# EAGLE schematic main (EAGLE 7.7.0)
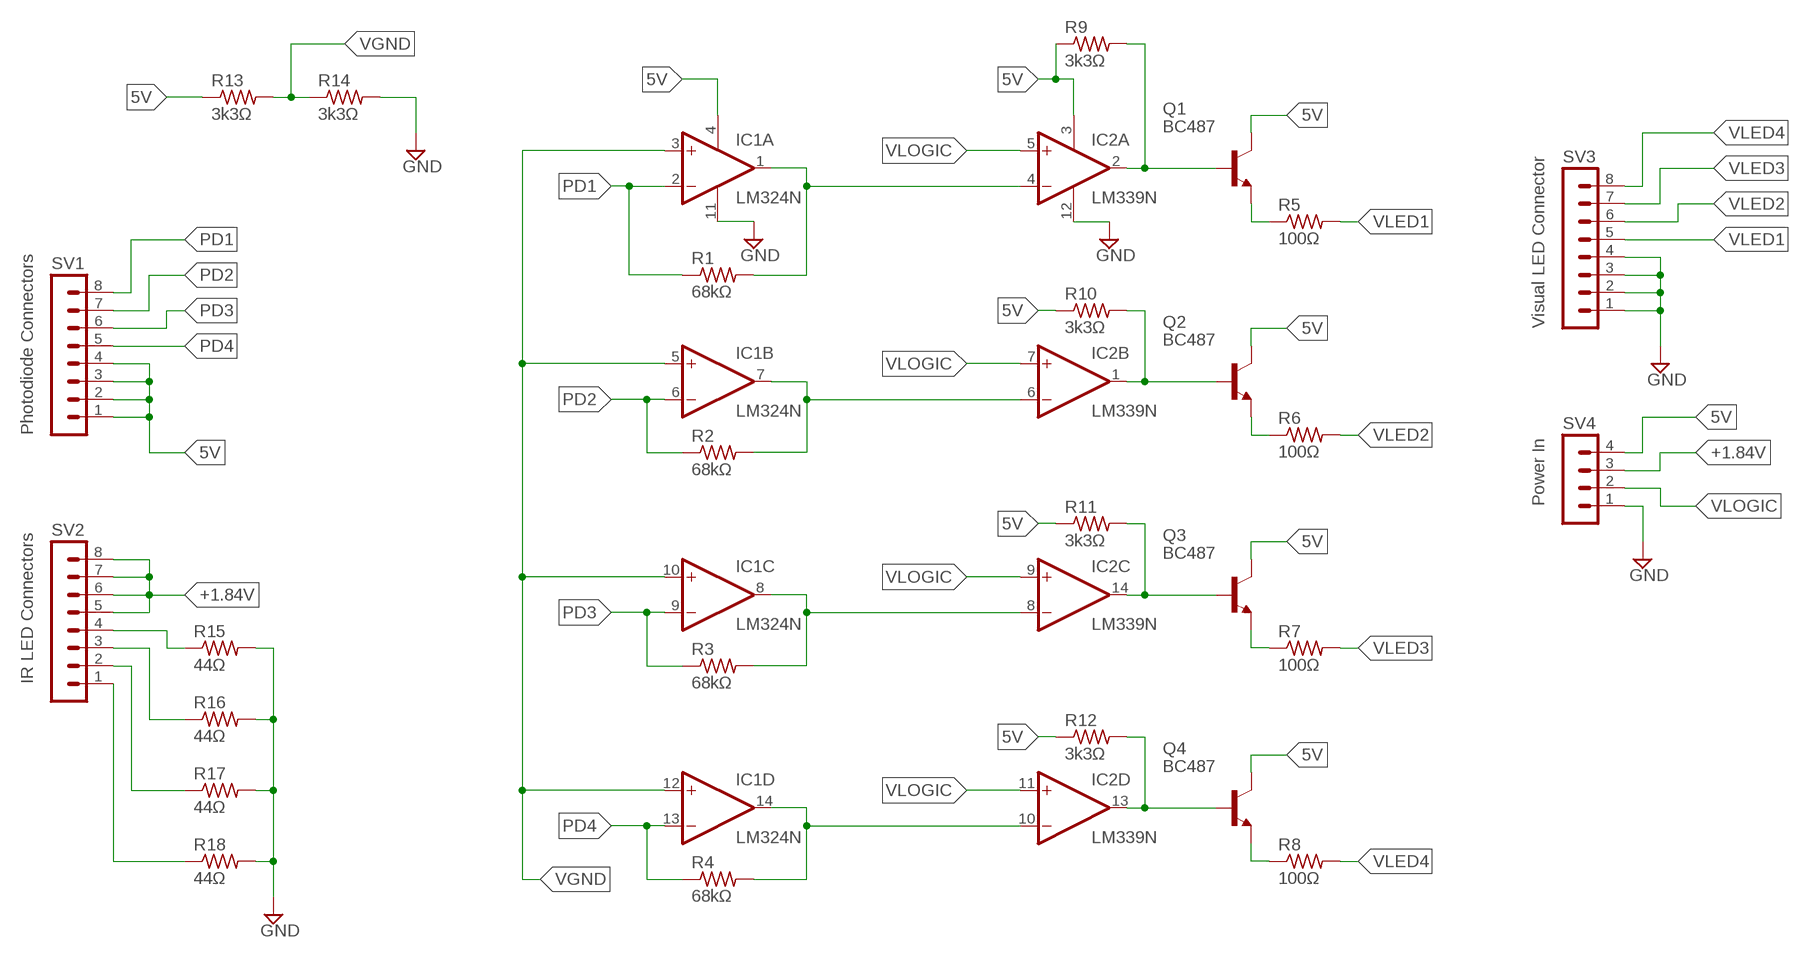
[diagram p0: schematic, sheet 1]

## Parts
IC1  LM324N  [DIL14]
IC2  LM339N  [DIL14]
Q1  BC487  [TO92-EBC]
Q2  BC487  [TO92-EBC]
Q3  BC487  [TO92-EBC]
Q4  BC487  [TO92-EBC]
R1  68kΩ  R-US_0204/7  [0204/7]
R2  68kΩ  R-US_0204/7  [0204/7]
R3  68kΩ  R-US_0204/7  [0204/7]
R4  68kΩ  R-US_0204/7  [0204/7]
R5  100Ω  R-US_0204/7  [0204/7]
R6  100Ω  R-US_0204/7  [0204/7]
R7  100Ω  R-US_0204/7  [0204/7]
R8  100Ω  R-US_0204/7  [0204/7]
R9  3k3Ω  R-US_0204/7  [0204/7]
R10  3k3Ω  R-US_0204/7  [0204/7]
R11  3k3Ω  R-US_0204/7  [0204/7]
R12  3k3Ω  R-US_0204/7  [0204/7]
R13  3k3Ω  R-US_0204/7  [0204/7]
R14  3k3Ω  R-US_0204/7  [0204/7]
R15  44Ω  R-US_0204/7  [0204/7]
R16  44Ω  R-US_0204/7  [0204/7]
R17  44Ω  R-US_0204/7  [0204/7]
R18  44Ω  R-US_0204/7  [0204/7]
SV1  Photodiode Connectors  MA08-1  [MA08-1]
SV2  IR LED Connectors  MA08-1  [MA08-1]
SV3  Visual LED Connector  MA08-1  [MA08-1]
SV4  Power In  MA04-1  [MA04-1]

## Nets
5V: IC1.4(P:V+) IC2.3(P:V+) Q1.C Q2.C Q3.C Q4.C R9.1 R10.1 R11.1 R12.1 R13.1 SV1.1 SV1.2 SV1.3 SV1.4 SV4.4
+1.84V: SV2.5 SV2.6 SV2.7 SV2.8 SV4.3
GND: IC1.11(P:V-) IC2.12(P:GND) R14.2 R15.2 R16.2 R17.2 R18.2 SV3.1 SV3.2 SV3.3 SV3.4 SV4.1
N$1: Q1.E R5.1
N$2: IC1.1(A:OUT) IC2.4(A:-IN) R1.2
N$3: IC1.7(B:OUT) IC2.6(B:-IN) R2.2
N$4: Q2.E R6.1
N$5: Q3.E R7.1
N$6: Q4.E R8.1
N$7: IC1.14(D:OUT) IC2.10(D:-IN) R4.2
N$8: IC2.14(C:OUT) Q3.B R11.2
N$9: IC2.13(D:OUT) Q4.B R12.2
N$10: IC2.1(B:OUT) Q2.B R10.2
N$11: IC2.2(A:OUT) Q1.B R9.2
N$12: R15.1 SV2.4
N$13: R16.1 SV2.3
N$14: R17.1 SV2.2
N$15: R18.1 SV2.1
PD1: IC1.2(A:-IN) R1.1 SV1.8
PD2: IC1.6(B:-IN) R2.1 SV1.7
PD3: IC1.9(C:-IN) R3.1 SV1.6
PD4: IC1.13(D:-IN) R4.1 SV1.5
VGND: IC1.3(A:+IN) IC1.5(B:+IN) IC1.10(C:+IN) IC1.12(D:+IN) R13.2 R14.1
VLED1: R5.2 SV3.5
VLED2: R6.2 SV3.6
VLED3: R7.2 SV3.7
VLED4: R8.2 SV3.8
VLOGIC: IC1.8(C:OUT) IC2.5(A:+IN) IC2.7(B:+IN) IC2.8(C:-IN) IC2.9(C:+IN) IC2.11(D:+IN) R3.2 SV4.2

## Library data of the parts
IC1 = linear:LM324: OP AMP
IC2 = linear:LM339: Low Power Low Offset Voltage Quad Comparators with open collector; LM139/LM239/LM339/LM2901/LM3302
Q1-Q4 = transistor-npn:BC487*: NPN Transistor
R1-R18 = resistor:R-US_: RESISTOR, American symbol
SV1-SV3 = con-lstb:MA08-1: PIN HEADER; OC_FARNELL: unknown; OC_NEWARK: unknown
SV4 = con-lstb:MA04-1: PIN HEADER; OC_FARNELL: unknown; OC_NEWARK: unknown